# Altium project LED_board.PrjPcb
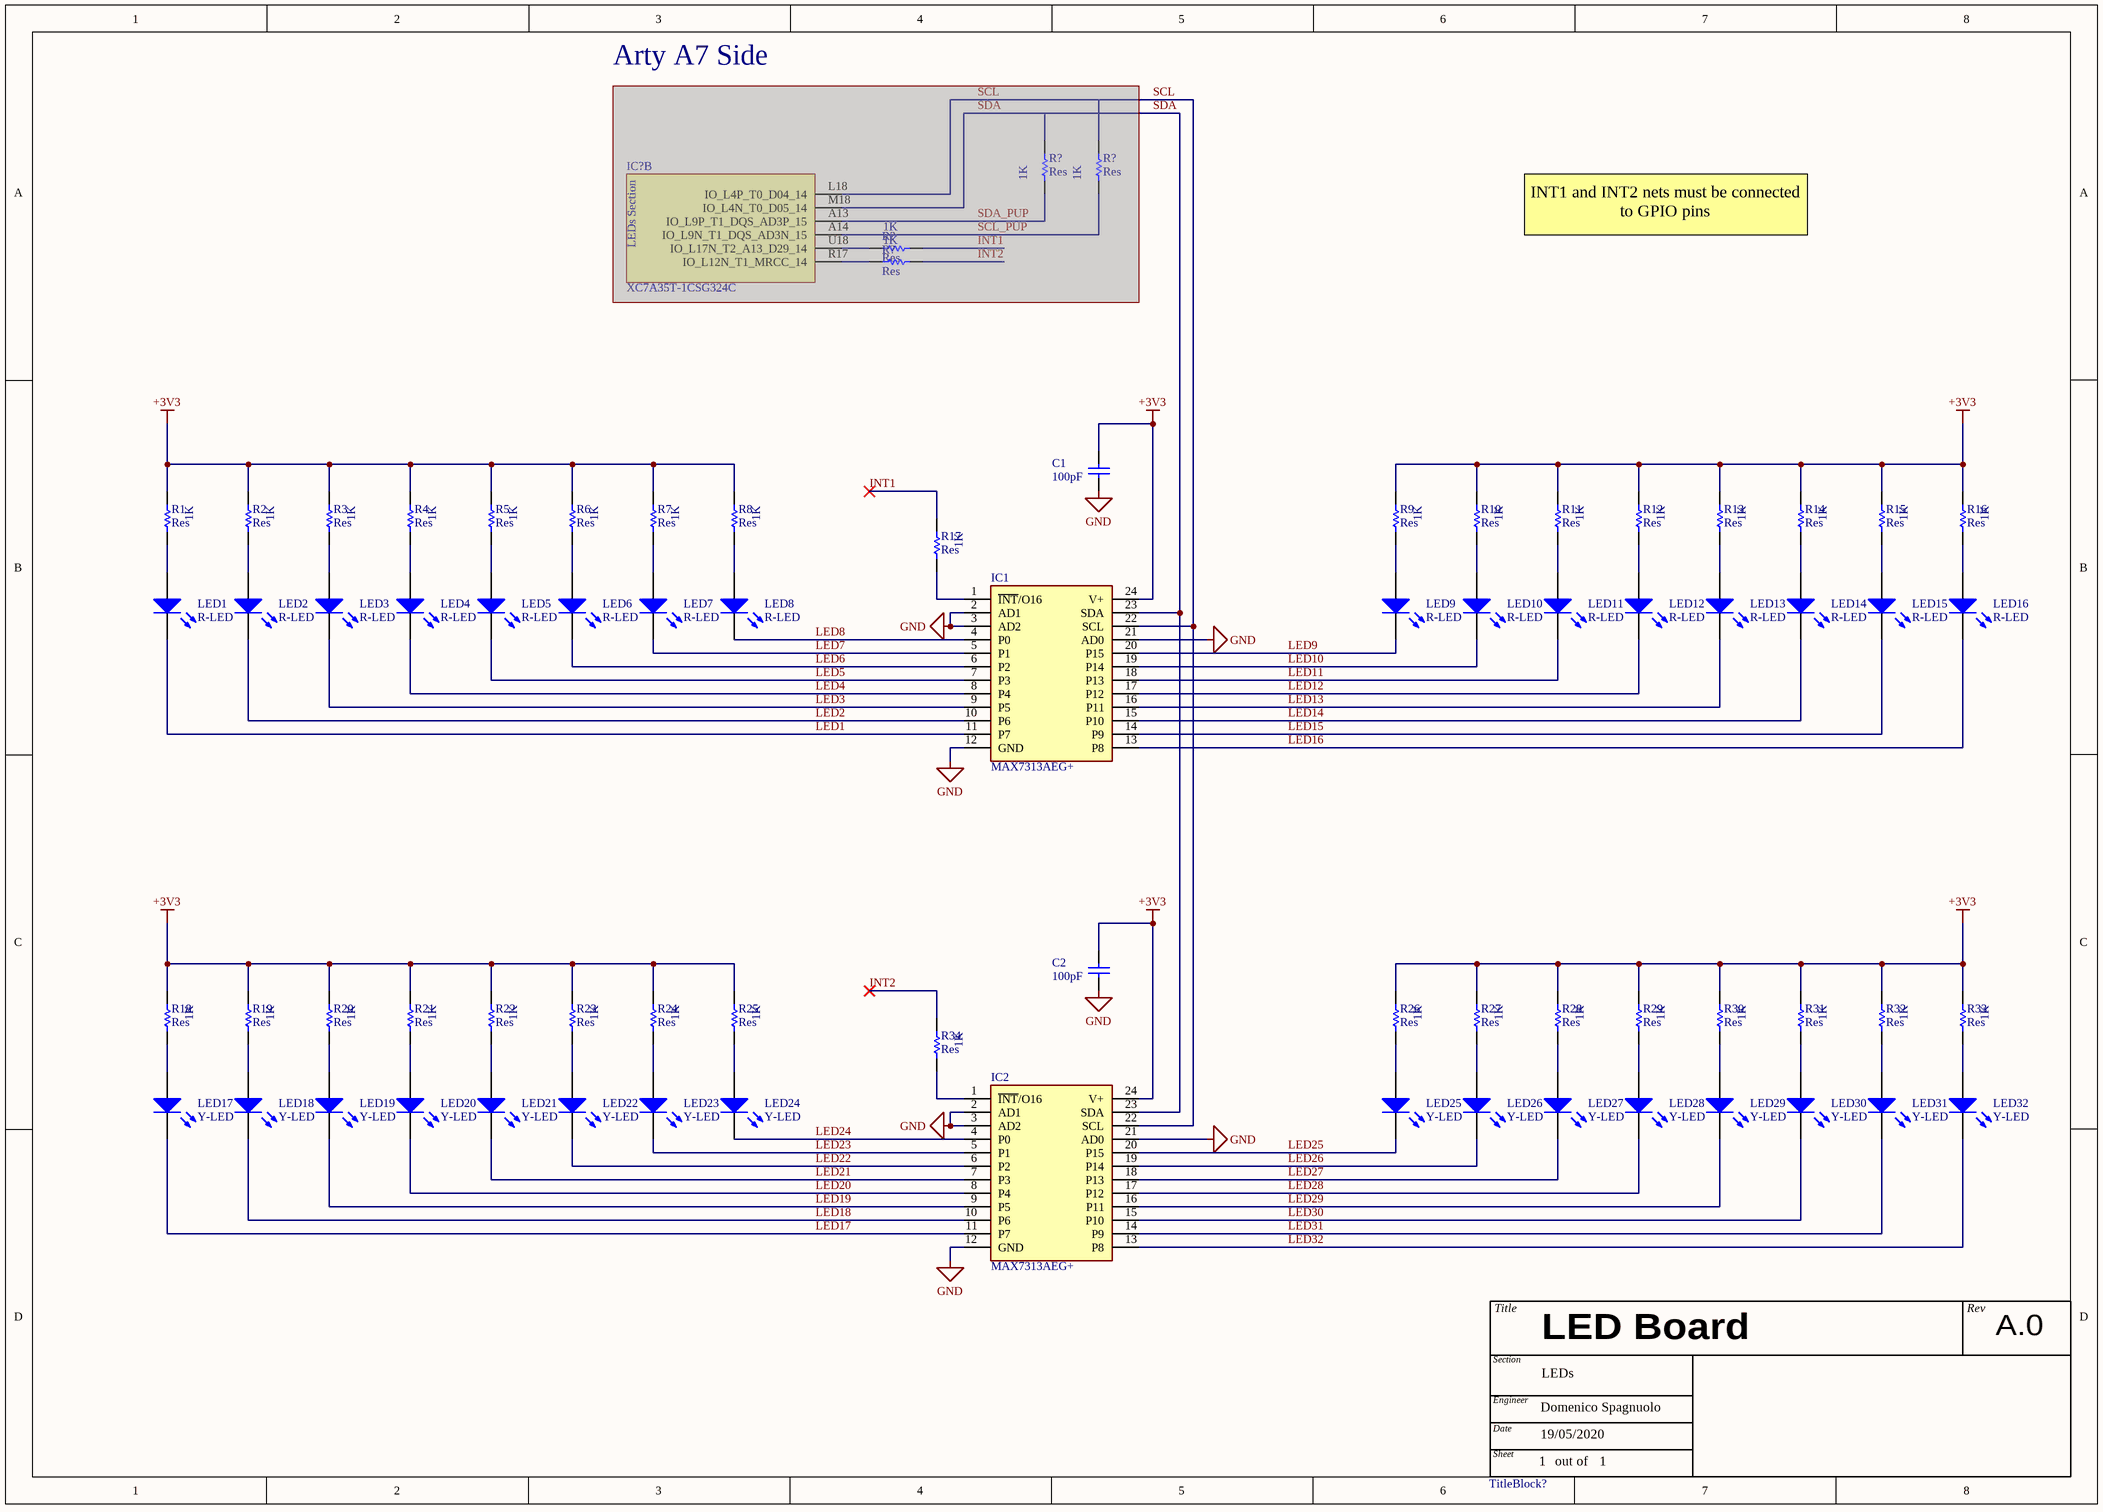
[diagram p0: LED.SchDoc]
Section: LEDs; Rev: A.0; Engineer: Domenico Spagnuolo
1 sheet, 76 parts. Net scope: global (net labels, ports and power ports of the same name join across sheets).

## Sheet LED.SchDoc
size A3; Date: 19/05/2020; Engineer: Domenico Spagnuolo; DocumentNumber: 1; SheetNumber: 1; SheetTotal: 1

### Parts
(Parts that share a designator on the sheet are numbered #1, #2 ... from top to bottom, then left to right.)
C1  value 100pF  [CAP 0805]  (hidden comment: Cap)
C2  value 100pF  [CAP 0805]  (hidden comment: Cap)
IC1  MAX7313AEG+  [SOP64P602X175-24N]
IC2  MAX7313AEG+  [SOP64P602X175-24N]
IC?  XC7A35T-1CSG324C  [BGA324C80P18X18_1500X1500X150]  (part B of 3)  (masked out: inside a compile mask, not in the netlist)
LED1  R-LED  [LED RED 0805]
LED2  R-LED  [LED RED 0805]
LED3  R-LED  [LED RED 0805]
LED4  R-LED  [LED RED 0805]
LED5  R-LED  [LED RED 0805]
LED6  R-LED  [LED RED 0805]
LED7  R-LED  [LED RED 0805]
LED8  R-LED  [LED RED 0805]
LED9  R-LED  [LED RED 0805]
LED10  R-LED  [LED RED 0805]
LED11  R-LED  [LED RED 0805]
LED12  R-LED  [LED RED 0805]
LED13  R-LED  [LED RED 0805]
LED14  R-LED  [LED RED 0805]
LED15  R-LED  [LED RED 0805]
LED16  R-LED  [LED RED 0805]
LED17  Y-LED  [LED YELLOW 0805]
LED18  Y-LED  [LED YELLOW 0805]
LED19  Y-LED  [LED YELLOW 0805]
LED20  Y-LED  [LED YELLOW 0805]
LED21  Y-LED  [LED YELLOW 0805]
LED22  Y-LED  [LED YELLOW 0805]
LED23  Y-LED  [LED YELLOW 0805]
LED24  Y-LED  [LED YELLOW 0805]
LED25  Y-LED  [LED YELLOW 0805]
LED26  Y-LED  [LED YELLOW 0805]
LED27  Y-LED  [LED YELLOW 0805]
LED28  Y-LED  [LED YELLOW 0805]
LED29  Y-LED  [LED YELLOW 0805]
LED30  Y-LED  [LED YELLOW 0805]
LED31  Y-LED  [LED YELLOW 0805]
LED32  Y-LED  [LED YELLOW 0805]
R1  Res  value 1K  [RES 0805]
R2  Res  value 1K  [RES 0805]
R3  Res  value 1K  [RES 0805]
R4  Res  value 1K  [RES 0805]
R5  Res  value 1K  [RES 0805]
R6  Res  value 1K  [RES 0805]
R7  Res  value 1K  [RES 0805]
R8  Res  value 1K  [RES 0805]
R9  Res  value 1K  [RES 0805]
R10  Res  value 1K  [RES 0805]
R11  Res  value 1K  [RES 0805]
R12  Res  value 1K  [RES 0805]
R13  Res  value 1K  [RES 0805]
R14  Res  value 1K  [RES 0805]
R15  Res  value 1K  [RES 0805]
R16  Res  value 1K  [RES 0805]
R17  Res  value 1K  [RES 0805]
R18  Res  value 1K  [RES 0805]
R19  Res  value 1K  [RES 0805]
R20  Res  value 1K  [RES 0805]
R21  Res  value 1K  [RES 0805]
R22  Res  value 1K  [RES 0805]
R23  Res  value 1K  [RES 0805]
R24  Res  value 1K  [RES 0805]
R25  Res  value 1K  [RES 0805]
R26  Res  value 1K  [RES 0805]
R27  Res  value 1K  [RES 0805]
R28  Res  value 1K  [RES 0805]
R29  Res  value 1K  [RES 0805]
R30  Res  value 1K  [RES 0805]
R31  Res  value 1K  [RES 0805]
R32  Res  value 1K  [RES 0805]
R33  Res  value 1K  [RES 0805]
R34  Res  value 1K  [RES 0805]
R?#1  Res  value 1K  [RES 0805]  (masked out: inside a compile mask, not in the netlist)
R?#2  Res  value 1K  [RES 0805]  (masked out: inside a compile mask, not in the netlist)
R?#3  Res  value 1K  [RES 0805]  (masked out: inside a compile mask, not in the netlist)
R?#4  Res  value 1K  [RES 0805]  (masked out: inside a compile mask, not in the netlist)
TitleBlock?  Title Block  (value not drawn)  (graphical)

### Nets
+3V3: C1.2 C2.2 IC1.24(V+) IC2.24(V+) R1.1 R2.1 R3.1 R4.1 R5.1 R6.1 R7.1 R8.1 R9.1 R10.1 R11.1 R12.1 R13.1 R14.1 R15.1 R16.1 R18.1 R19.1 R20.1 R21.1 R22.1 R23.1 R24.1 R25.1 R26.1 R27.1 R28.1 R29.1 R30.1 R31.1 R32.1 R33.1
GND: C1.1 C2.1 IC1.2(AD1) IC1.3(AD2) IC1.12(GND) IC1.21(AD0) IC2.2(AD1) IC2.3(AD2) IC2.12(GND) IC2.21(AD0)
INT1: R17.1
INT2: R34.1
LED1: IC1.11(P7) LED1.K
LED2: IC1.10(P6) LED2.K
LED3: IC1.9(P5) LED3.K
LED4: IC1.8(P4) LED4.K
LED5: IC1.7(P3) LED5.K
LED6: IC1.6(P2) LED6.K
LED7: IC1.5(P1) LED7.K
LED8: IC1.4(P0) LED8.K
LED9: IC1.20(P15) LED9.K
LED10: IC1.19(P14) LED10.K
LED11: IC1.18(P13) LED11.K
LED12: IC1.17(P12) LED12.K
LED13: IC1.16(P11) LED13.K
LED14: IC1.15(P10) LED14.K
LED15: IC1.14(P9) LED15.K
LED16: IC1.13(P8) LED16.K
LED17: IC2.11(P7) LED17.K
LED18: IC2.10(P6) LED18.K
LED19: IC2.9(P5) LED19.K
LED20: IC2.8(P4) LED20.K
LED21: IC2.7(P3) LED21.K
LED22: IC2.6(P2) LED22.K
LED23: IC2.5(P1) LED23.K
LED24: IC2.4(P0) LED24.K
LED25: IC2.20(P15) LED25.K
LED26: IC2.19(P14) LED26.K
LED27: IC2.18(P13) LED27.K
LED28: IC2.17(P12) LED28.K
LED29: IC2.16(P11) LED29.K
LED30: IC2.15(P10) LED30.K
LED31: IC2.14(P9) LED31.K
LED32: IC2.13(P8) LED32.K
SCL: IC1.22(SCL) IC2.22(SCL)
SDA: IC1.23(SDA) IC2.23(SDA)
NetIC1_1: IC1.1(~{INT}/O16) R17.2
NetIC2_1: IC2.1(~{INT}/O16) R34.2
NetLED1_A: LED1.A R1.2
NetLED2_A: LED2.A R2.2
NetLED3_A: LED3.A R3.2
NetLED4_A: LED4.A R4.2
NetLED5_A: LED5.A R5.2
NetLED6_A: LED6.A R6.2
NetLED7_A: LED7.A R7.2
NetLED8_A: LED8.A R8.2
NetLED9_A: LED9.A R9.2
NetLED10_A: LED10.A R10.2
NetLED11_A: LED11.A R11.2
NetLED12_A: LED12.A R12.2
NetLED13_A: LED13.A R13.2
NetLED14_A: LED14.A R14.2
NetLED15_A: LED15.A R15.2
NetLED16_A: LED16.A R16.2
NetLED17_A: LED17.A R18.2
NetLED18_A: LED18.A R19.2
NetLED19_A: LED19.A R20.2
NetLED20_A: LED20.A R21.2
NetLED21_A: LED21.A R22.2
NetLED22_A: LED22.A R23.2
NetLED23_A: LED23.A R24.2
NetLED24_A: LED24.A R25.2
NetLED25_A: LED25.A R26.2
NetLED26_A: LED26.A R27.2
NetLED27_A: LED27.A R28.2
NetLED28_A: LED28.A R29.2
NetLED29_A: LED29.A R30.2
NetLED30_A: LED30.A R31.2
NetLED31_A: LED31.A R32.2
NetLED32_A: LED32.A R33.2

### Notes on the sheet
- Arty A7 Side
- INT1 and INT2 nets must be connected to GPIO pins
- (in symbol TitleBlock) Title; Rev; LED Board; Section; Engineer; Date; Sheet; out of
- (in symbol XC7A35T-1CSG324C, part B) LEDs Section

### Library data of the parts
C1 C2 = Cap: Capacitor; Published: 8-Jun-2000; LatestRevisionDate: 17-Jul-2002; LatestRevisionNote: Re-released for DXP Platform.; PackageReference: RAD-0.3; Publisher: Altium Limited; PackageDescription: Radial Cap, Thru-Hole; 2 Leads; 0.3 in Pin Spacing
IC1 IC2 = MAX7313AEG+: GPIO Port Expander; Manufacturer_Name: Maxim Integrated; Datasheet Link: http://datasheets.maximintegrated.com/en/ds/MAX7313.pdf; Height: 1.75mm; Manufacturer_Part_Number: MAX7313AEG+; Mouser Part Number: 700-MAX7313AEG; Mouser Price/Stock: https://www.mouser.co.uk/ProductDetail/Maxim-Integrated/MAX7313AEG%2b?qs=LHmEVA8xxfbu9TMdrEq27g%3D%3D; RS Part Number: 1900494P; RS Price/Stock: http://uk.rs-online.com/web/p/products/1900494P
IC? = XC7A35T-1CSG324C: Integrated Circuit; Manufacturer_Name: XILINX; Datasheet Link: http://www.xilinx.com/support/documentation/data_sheets/ds180_7Series_Overview.pdf; Height: 1.5mm; Manufacturer_Part_Number: XC7A35T-1CSG324C; Mouser Part Number: 217-XC7A35T-1CSG324C; Mouser Price/Stock: https://www.mouser.co.uk/ProductDetail/Xilinx/XC7A35T-1CSG324C?qs=rrS6PyfT74cxvR58nHYPWA%3D%3D
LED1-LED16 = R-LED: Red LED; Published: 8-Jun-2000; LatestRevisionDate: 08-Jul-2005; LatestRevisionNote: Mech Layer 1 removed.; Publisher: Altium Limited; PackageDescription: LED; 2 Leads; PackageReference: LED-0
LED17-LED32 = Y-LED: Yellow LED; Published: 8-Jun-2000; LatestRevisionDate: 08-Jul-2005; LatestRevisionNote: Mech Layer 1 removed.; Publisher: Altium Limited; PackageDescription: LED; 2 Leads; PackageReference: LED-0
R1-R34 R?#1-R?#4 = Res: Resistor; Published: 8-Jun-2000; LatestRevisionDate: 17-Jul-2002; LatestRevisionNote: Re-released for DXP Platform.; PackageReference: AXIAL-0.3; Publisher: Altium Limited; PackageDescription: Axial Device, Thru-Hole; 2 Leads; 0.3 in Pin Spacing
TitleBlock? = TitleBlock